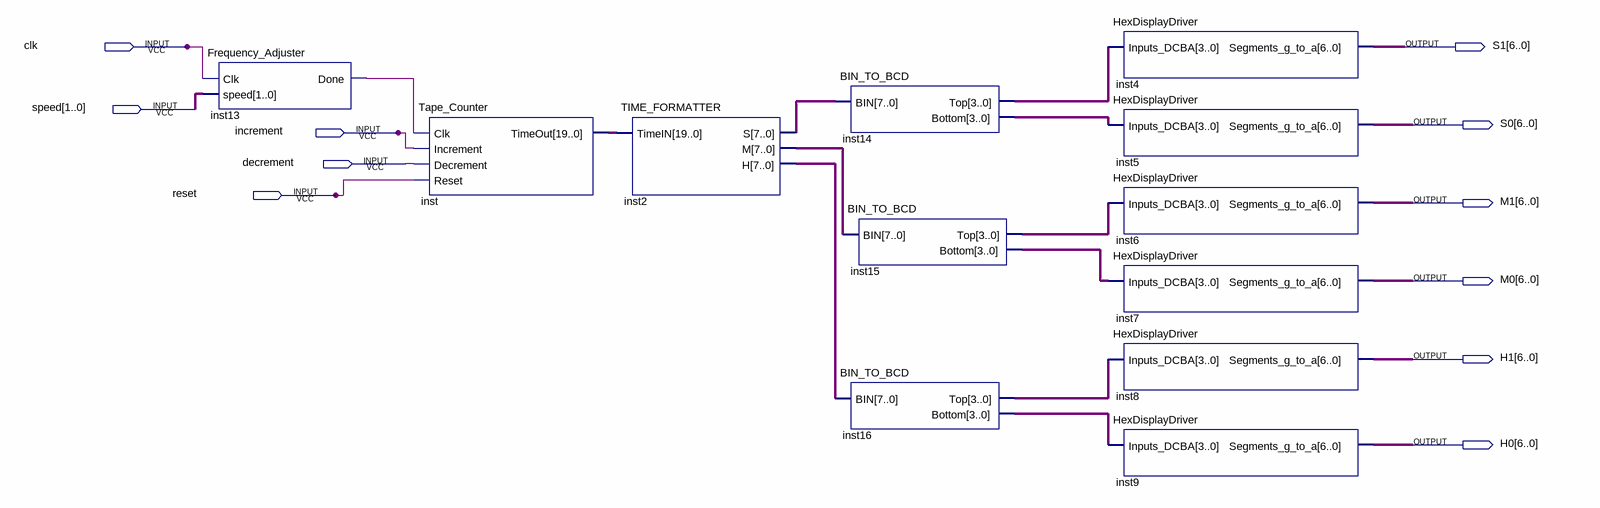
[diagram p0: schematic sheet]
// Quartus schematic VCR_Tape_Counter.bdf as structural Verilog: 12 symbols, 11 pins
module VCR_Tape_Counter (
  input  clk,
  input  [1:0] speed,
  input  increment,
  input  decrement,
  input  reset,
  output [6:0] S1,
  output [6:0] S0,
  output [6:0] M1,
  output [6:0] M0,
  output [6:0] H1,
  output [6:0] H0
);

  wire inst13_done;
  wire [3:0] inst14_bottom, inst14_top, inst15_bottom, inst15_top, inst16_bottom, inst16_top;
  wire [7:0] inst2_h, inst2_m, inst2_s;
  wire [19:0] inst_timeout;

  Frequency_Adjuster inst13 (.Clk(clk), .speed(speed), .Done(inst13_done));
  Tape_Counter inst (
    .Clk(inst13_done), .Increment(increment), .Decrement(decrement), .Reset(reset), .TimeOut(inst_timeout));
  TIME_FORMATTER inst2 (.TimeIN(inst_timeout), .S(inst2_s), .M(inst2_m), .H(inst2_h));
  BIN_TO_BCD inst14 (.BIN(inst2_s), .Top(inst14_top), .Bottom(inst14_bottom));
  BIN_TO_BCD inst15 (.BIN(inst2_m), .Top(inst15_top), .Bottom(inst15_bottom));
  BIN_TO_BCD inst16 (.BIN(inst2_h), .Top(inst16_top), .Bottom(inst16_bottom));
  HexDisplayDriver inst4 (.Inputs_DCBA(inst14_top), .Segments_g_to_a(S1));
  HexDisplayDriver inst5 (.Inputs_DCBA(inst14_bottom), .Segments_g_to_a(S0));
  HexDisplayDriver inst6 (.Inputs_DCBA(inst15_top), .Segments_g_to_a(M1));
  HexDisplayDriver inst7 (.Inputs_DCBA(inst15_bottom), .Segments_g_to_a(M0));
  HexDisplayDriver inst8 (.Inputs_DCBA(inst16_top), .Segments_g_to_a(H1));
  HexDisplayDriver inst9 (.Inputs_DCBA(inst16_bottom), .Segments_g_to_a(H0));
endmodule
